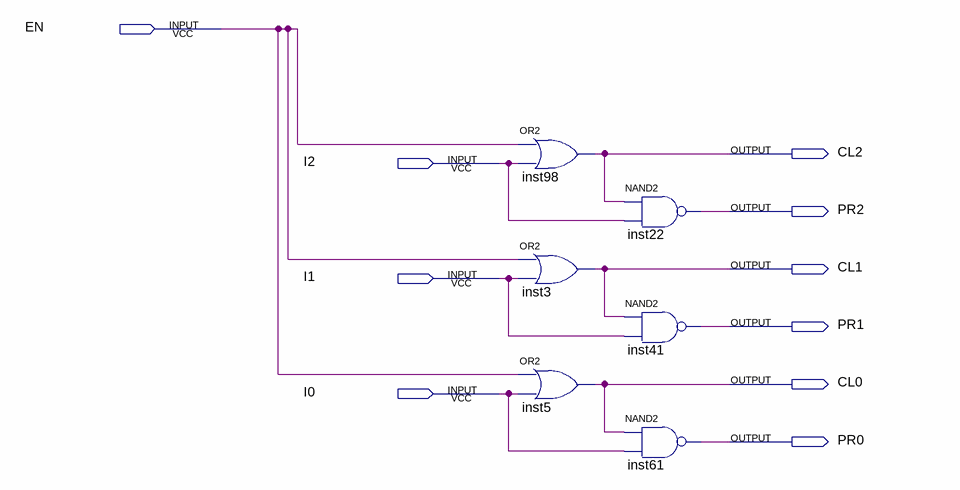
[diagram p0: schematic sheet]
// Quartus schematic NAP.bdf as structural Verilog: 6 symbols, 10 pins
module NAP (
  input  EN,
  input  I2,
  input  I1,
  input  I0,
  output CL2,
  output PR2,
  output CL1,
  output PR1,
  output CL0,
  output PR0
);

  or inst98 (CL2, EN, I2);
  or inst3 (CL1, EN, I1);
  or inst5 (CL0, EN, I0);
  nand inst22 (PR2, CL2, I2);
  nand inst41 (PR1, CL1, I1);
  nand inst61 (PR0, CL0, I0);
endmodule
